# Altium schematic sheet Pec.SchDoc
size A3
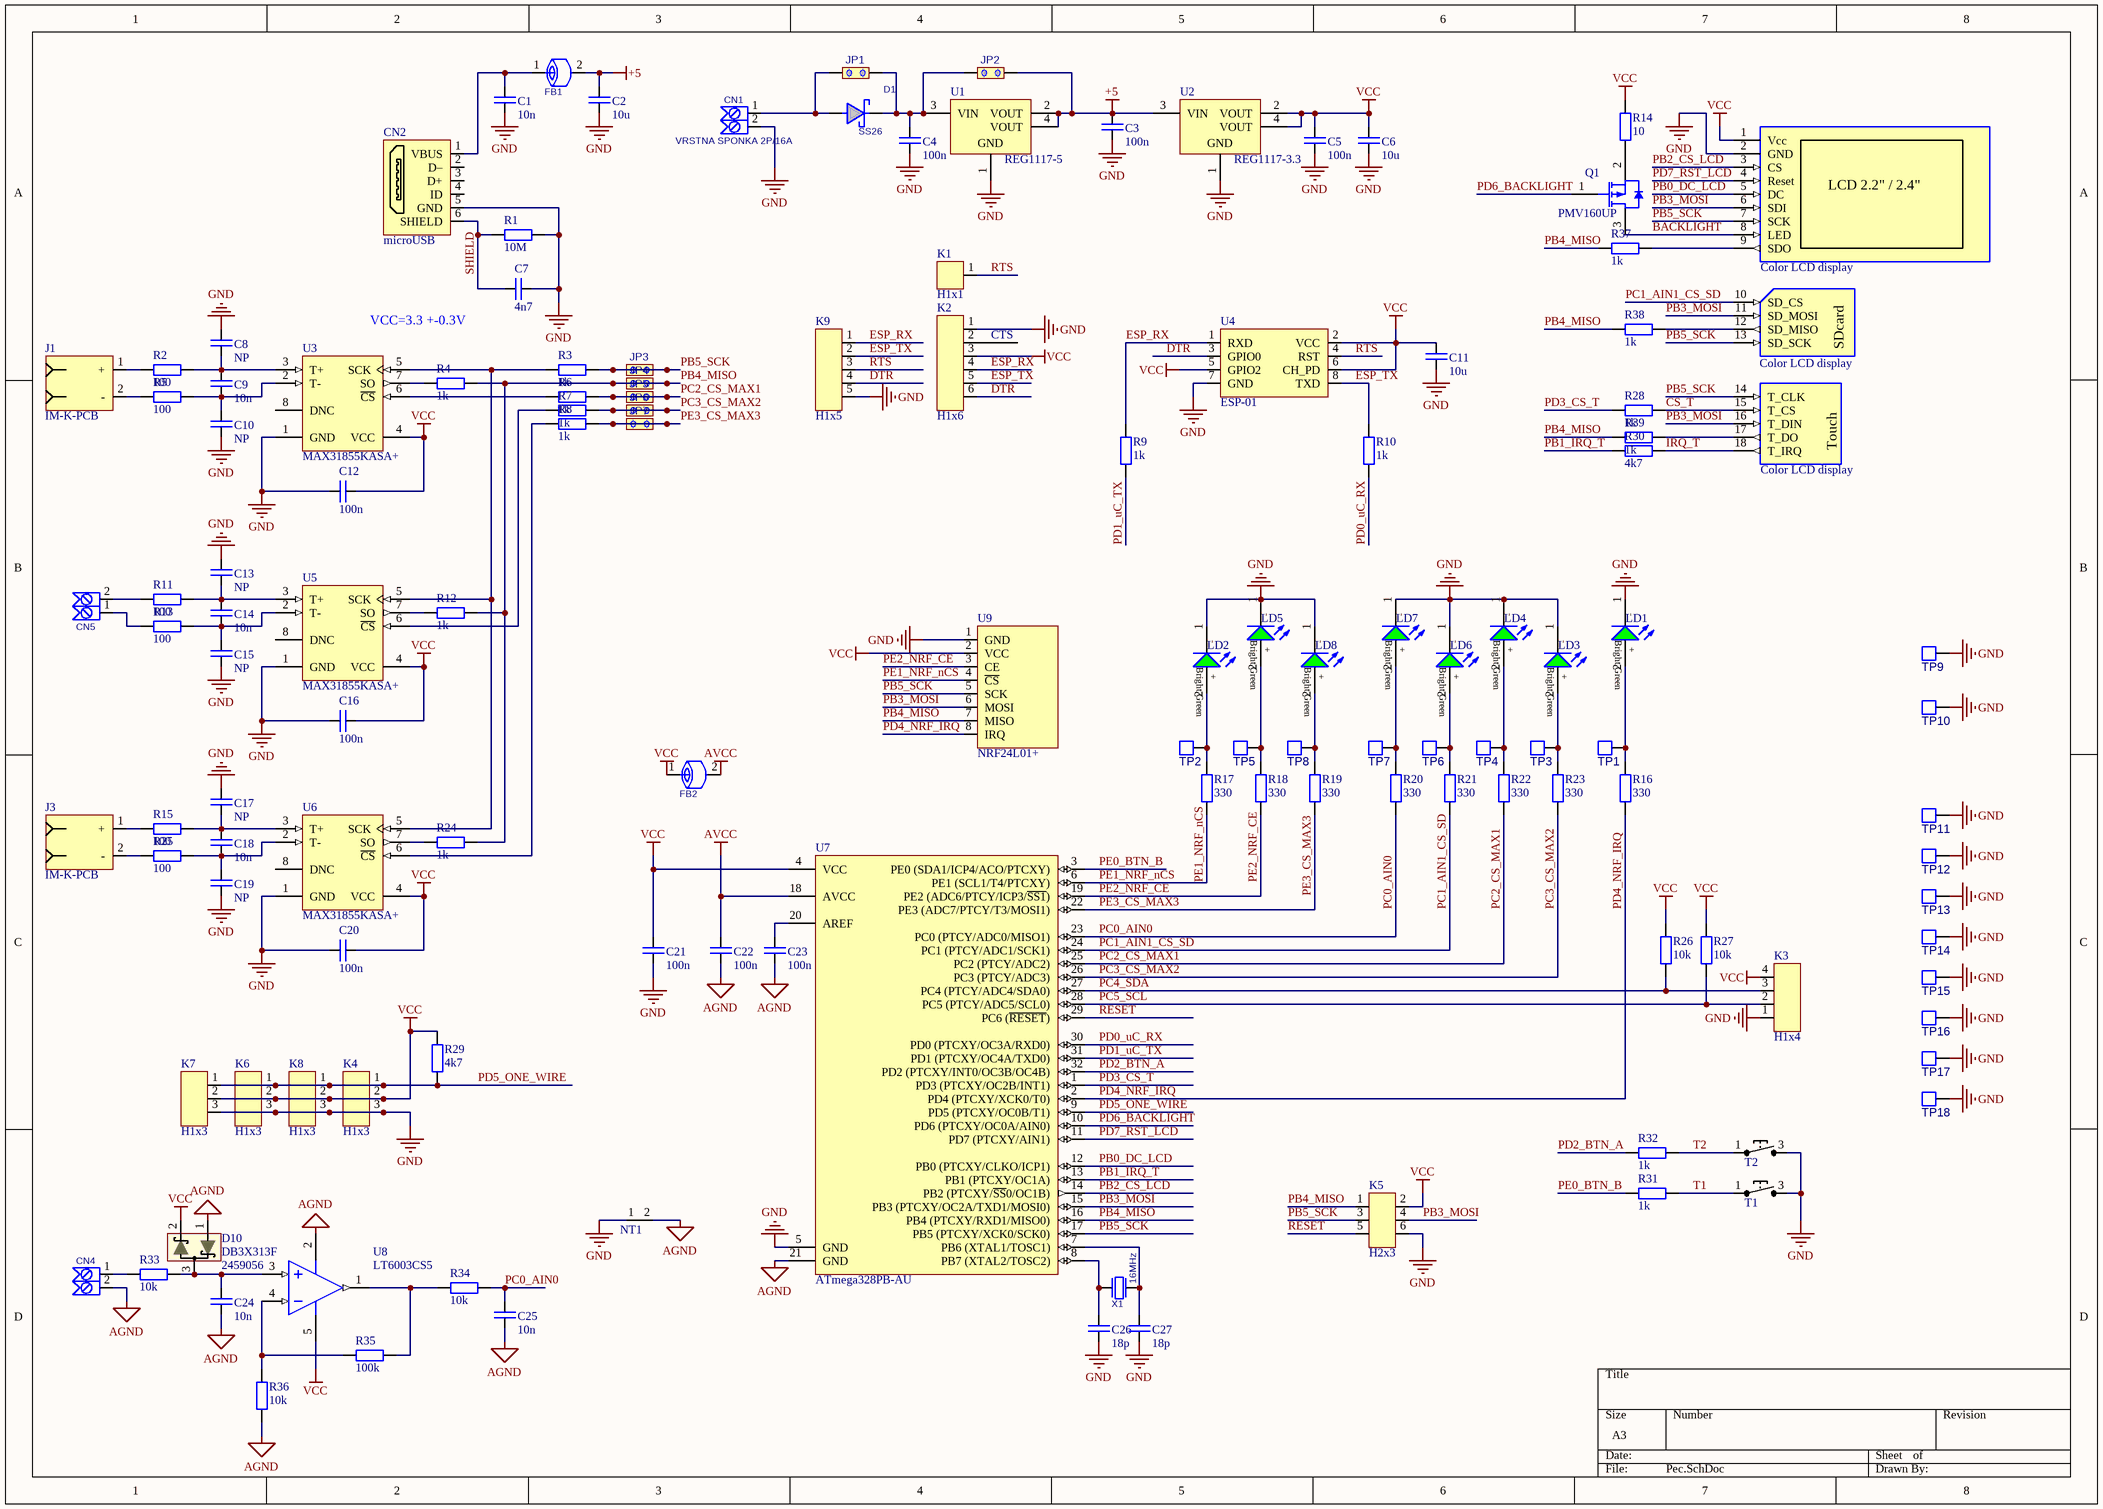
[diagram p0: Pec.SchDoc]

## Parts
C1  10n  [C2012_0805I_M]
C2  10u  [C3225_1210I_M]
C3  100n  [C2012_0805I_M]
C4  100n  [C2012_0805I_M]
C5  100n  [C2012_0805I_M]
C6  10u  [C3225_1210I_M]
C7  4n7  [C2012_0805I_M]
C8  NP  [C2012_0805I_M]
C9  10n  [C2012_0805I_M]
C10  NP  [C2012_0805I_M]
C11  10u  [C3225_1210I_M]
C12  100n  [C2012_0805I_M]
C13  NP  [C2012_0805I_M]
C14  10n  [C2012_0805I_M]
C15  NP  [C2012_0805I_M]
C16  100n  [C2012_0805I_M]
C17  NP  [C2012_0805I_M]
C18  10n  [C2012_0805I_M]
C19  NP  [C2012_0805I_M]
C20  100n  [C2012_0805I_M]
C21  100n  [C2012_0805I_M]
C22  100n  [C2012_0805I_M]
C23  100n  [C2012_0805I_M]
C24  10n  [C2012_0805I_M]
C25  10n  [C2012_0805I_M]
C26  18p  [C2012_0805I_M]
C27  18p  [C2012_0805I_M]
CN1  VRSTNA SPONKA 2P/16A  [VRSTNA SPONKA 2P/16A]
CN2  microUSB  [micro-USB-HRS-ZX62D-B-5PA8]
CN4  VRSTNA SPONKA 2P/16A  [VRSTNA SPONKA 2P/16A]  (value not drawn)
CN5  VRSTNA SPONKA 2P/16A  [VRSTNA SPONKA 2P/16A]  (value not drawn)
D1  SS26  [DO-214AA_SMB_M]
D10  DB3X313F  Supplier Part Number 1: 2459056  [SOT23]
FB1  FERITTE BEAD  [R2012_0805I_M]  (value not drawn)
FB2  FERITTE BEAD  [R2012_0805I_M]  (value not drawn)
J1  IM-K-PCB  [IM-x-PCB]
J3  IM-K-PCB  [IM-x-PCB]
JP1  JMP  [solderJumper]  (value not drawn)
JP2  JMP  [H1x2+solderJumper]  (value not drawn)
JP3  JMP  [H1x2]  (value not drawn)
JP4  JMP  [H1x2]  (value not drawn)
JP5  JMP  [H1x2]  (value not drawn)
JP6  JMP  [H1x2]  (value not drawn)
JP7  JMP  [H1x2]  (value not drawn)
K1  H1x1  [H1x1]
K2  H1x6  [H1x6]
K3  H1x4  [H1x4]
K4  H1x3  [H1x3]
K5  H2x3  [H2X3_SPEEDY]
K6  H1x3  [H1x3]
K7  H1x3  [H1x3]
K8  H1x3  [H1x3]
K9  H1x5  [H1x5]
LCD1  Color LCD display  [LCD_display]  (parts A,B,C of 3)
LD1  LED  [LED2012_0805I_M]  (value not drawn)
LD2  LED  [LED2012_0805I_M]  (value not drawn)
LD3  LED  [LED2012_0805I_M]  (value not drawn)
LD4  LED  [LED2012_0805I_M]  (value not drawn)
LD5  LED  [LED2012_0805I_M]  (value not drawn)
LD6  LED  [LED2012_0805I_M]  (value not drawn)
LD7  LED  [LED2012_0805I_M]  (value not drawn)
LD8  LED  [LED2012_0805I_M]  (value not drawn)
NT1  NetTie  [NetTie-10mil]  (value not drawn)  (net tie, no BOM)
Q1  PMV160UP  [NXP-SOT23_N]
R1  10M  [R2012_0805I_M]
R2  100  [R2012_0805I_M]
R3  1k  [R2012_0805I_M]
R4  1k  [R2012_0805I_M]
R5  100  [R2012_0805I_M]
R6  1k  [R2012_0805I_M]
R7  1k  [R2012_0805I_M]
R8  1k  [R2012_0805I_M]
R9  1k  [R2012_0805I_M]
R10  1k  [R2012_0805I_M]
R11  100  [R2012_0805I_M]
R12  1k  [R2012_0805I_M]
R13  100  [R2012_0805I_M]
R14  10  [R2012_0805I_M]
R15  100  [R2012_0805I_M]
R16  330  [R2012_0805I_M]
R17  330  [R2012_0805I_M]
R18  330  [R2012_0805I_M]
R19  330  [R2012_0805I_M]
R20  330  [R2012_0805I_M]
R21  330  [R2012_0805I_M]
R22  330  [R2012_0805I_M]
R23  330  [R2012_0805I_M]
R24  1k  [R2012_0805I_M]
R25  100  [R2012_0805I_M]
R26  10k  [R2012_0805I_M]
R27  10k  [R2012_0805I_M]
R28  1k  [R2012_0805I_M]
R29  4k7  [R2012_0805I_M]
R30  4k7  [R2012_0805I_M]
R31  1k  [R2012_0805I_M]
R32  1k  [R2012_0805I_M]
R33  10k  [R2012_0805I_M]
R34  10k  [R2012_0805I_M]
R35  100k  [R2012_0805I_M]
R36  10k  [R2012_0805I_M]
R37  1k  [R2012_0805I_M]
R38  1k  [R2012_0805I_M]
R39  1k  [R2012_0805I_M]
T1  Tipka_6x6  [Tipka 6x6]  (value not drawn)
T2  Tipka_6x6  [Tipka 6x6]  (value not drawn)
TP1  PAD  [PAD_HOLE]  (value not drawn)
TP2  PAD  [PAD_HOLE]  (value not drawn)
TP3  PAD  [PAD_HOLE]  (value not drawn)
TP4  PAD  [PAD_HOLE]  (value not drawn)
TP5  PAD  [PAD_HOLE]  (value not drawn)
TP6  PAD  [PAD_HOLE]  (value not drawn)
TP7  PAD  [PAD_HOLE]  (value not drawn)
TP8  PAD  [PAD_HOLE]  (value not drawn)
TP9  PAD  [PAD_CIRC_HOLE]  (value not drawn)
TP10  PAD  [PAD_CIRC_HOLE]  (value not drawn)
TP11  PAD  [PAD_CIRC_HOLE]  (value not drawn)
TP12  PAD  [PAD_CIRC_HOLE]  (value not drawn)
TP13  PAD  [PAD_CIRC_HOLE]  (value not drawn)
TP14  PAD  [PAD_CIRC_HOLE]  (value not drawn)
TP15  PAD  [PAD_CIRC_HOLE]  (value not drawn)
TP16  PAD  [PAD_CIRC_HOLE]  (value not drawn)
TP17  PAD  [PAD_CIRC_HOLE]  (value not drawn)
TP18  PAD  [PAD_CIRC_HOLE]  (value not drawn)
U1  REG1117-5  [TI-DCY4_N]
U2  REG1117-3.3  [TI-DCY4_N]
U3  MAX31855KASA+  [MAXM-S8+4_M]
U4  ESP-01  [ESP01]
U5  MAX31855KASA+  [MAXM-S8+4_M]
U6  MAX31855KASA+  [MAXM-S8+4_M]
U7  ATmega328PB-AU  [32A_N]
U8  LT6003CS5  [LT-S5-5-TSOT-23_M]
U9  NRF24L01+  [NRF24L01+tht_module]
X1  16MHz  [Crystal_HC49]

## Nets
+5: C2.1 C3.1 FB1.2 JP2.1 U1.2(VOUT) U1.4(VOUT) U2.3(VIN)
AGND: C22.2 C23.2 C24.2 C25.2 CN4.2 D10.1 NT1.2 R36.1 U7.21(GND) U8.2(V-)
AVCC: C22.1 FB2.2 U7.18(AVCC)
GND: C1.2 C2.2 C3.2 C4.2 C5.2 C6.2 C7.1 C8.1 C10.2 C11.2 C12.1 C13.1 C15.2 C16.1 C17.1 C19.2 C20.1 C21.2 C26.2 C27.2 CN1.2 CN2.5(GND) K2.1 K3.1 K4.3 K5.6 K6.3 K7.3 K8.3 K9.5 LCD1.2(GND) LCD1.M0(Screw) LD1.1(-) LD2.1(-) LD3.1(-) LD4.1(-) LD5.1(-) LD6.1(-) LD7.1(-) LD8.1(-) NT1.1 R1.2 T1.3 T2.3 TP9.1 TP10.1 TP11.1 TP12.1 TP13.1 TP14.1 TP15.1 TP16.1 TP17.1 TP18.1 U1.1(GND) U2.1(GND) U3.1(GND) U4.7(GND) U5.1(GND) U6.1(GND) U7.5(GND) U9.1(GND)
VCC: C5.1 C6.1 C11.1 C12.2 C16.2 C20.2 C21.1 D10.2 FB2.1 K2.3 K3.4 K4.2 K5.2 K6.2 K7.2 K8.2 LCD1.1(Vcc) R14.2 R26.2 R27.2 R29.2 U2.2(VOUT) U2.4(VOUT) U3.4(VCC) U4.2(VCC) U4.5(GPIO2) U4.6(CH_PD) U5.4(VCC) U6.4(VCC) U7.4(VCC) U8.5(V+) U9.2(VCC)
BACKLIGHT: LCD1.8(LED) Q1.3(D)
CS_T: LCD1.15(T_CS) R28.2
DTR: K2.6 K9.4 U4.3(GPIO0)
ESP_RX: K2.4 K9.1 R9.2 U4.1(RXD)
ESP_TX: K2.5 K9.2 R10.2 U4.8(TXD)
IRQ_T: LCD1.18(T_IRQ) R30.2
PB0_DC_LCD: LCD1.5(DC) U7.12(PB0_(PTCXY/CLKO/ICP1))
PB1_IRQ_T: R30.1 U7.13(PB1_(PTCXY/OC1A))
PB2_CS_LCD: LCD1.3(CS) U7.14(PB2_(PTCXY/~{SS}0/OC1B))
PB3_MOSI: K5.4 LCD1.6(SDI) LCD1.11(SD_MOSI) LCD1.16(T_DIN) U7.15(PB3_(PTCXY/OC2A/TXD1/MOSI0)) U9.6(MOSI)
PB4_MISO: JP4.1 JP4.2 K5.1 R4.2 R12.2 R24.2 R37.1 R38.1 R39.1 U7.16(PB4_(PTCXY/RXD1/MISO0)) U9.7(MISO)
PB5_SCK: JP3.1 JP3.2 K5.3 LCD1.7(SCK) LCD1.13(SD_SCK) LCD1.14(T_CLK) R3.2 U7.17(PB5_(PTCXY/XCK0/SCK0)) U9.5(SCK)
PC0_AIN0: C25.1 R20.1 R34.2 U7.23(PC0_(PTCY/ADC0/MISO1))
PC1_AIN1_CS_SD: LCD1.10(SD_CS) R21.1 U7.24(PC1_(PTCY/ADC1/SCK1))
PC2_CS_MAX1: JP5.1 JP5.2 R6.2 R22.1 U7.25(PC2_(PTCY/ADC2))
PC3_CS_MAX2: JP6.1 JP6.2 R7.2 R23.1 U7.26(PC3_(PTCY/ADC3))
PC4_SDA: K3.3 R26.1 U7.27(PC4_(PTCY/ADC4/SDA0))
PC5_SCL: K3.2 R27.1 U7.28(PC5_(PTCY/ADC5/SCL0))
PD0_uC_RX: R10.1 U7.30(PD0_(PTCXY/OC3A/RXD0))
PD1_uC_TX: R9.1 U7.31(PD1_(PTCXY/OC4A/TXD0))
PD2_BTN_A: R32.1 U7.32(PD2_(PTCXY/INT0/OC3B/OC4B))
PD3_CS_T: R28.1 U7.1(PD3_(PTCXY/OC2B/INT1))
PD4_NRF_IRQ: R16.1 U7.2(PD4_(PTCXY/XCK0/T0)) U9.8(IRQ)
PD5_ONE_WIRE: K4.1 K6.1 K7.1 K8.1 R29.1 U7.9(PD5_(PTCXY/OC0B/T1))
PD6_BACKLIGHT: Q1.1(G) U7.10(PD6_(PTCXY/OC0A/AIN0))
PD7_RST_LCD: LCD1.4(Reset) U7.11(PD7_(PTCXY/AIN1))
PE0_BTN_B: R31.2 U7.3(PE0_(SDA1/ICP4/ACO/PTCXY))
PE1_NRF_nCS: R17.1 U7.6(PE1_(SCL1/T4/PTCXY)) U9.4(~{CS})
PE2_NRF_CE: R18.1 U7.19(PE2_(ADC6/PTCY/ICP3/~{SS1})) U9.3(CE)
PE3_CS_MAX3: JP7.1 JP7.2 R8.2 R19.1 U7.22(PE3_(ADC7/PTCY/T3/MOSI1))
RESET: K5.5 U7.29(PC6_(~{RESET}))
RTS: K1.1 K9.3 U4.4(RST)
SHIELD: C7.2 CN2.6(SHIELD) R1.1
T1: R31.1 T1.1
T2: R32.2 T2.1
NetC1_1: C1.1 CN2.1(VBUS) FB1.1
NetC4_1: C4.1 D1.K JP1.1 JP2.2 U1.3(VIN)
NetC8_2: C8.2 C9.1 R2.2 U3.3(T+)
NetC9_2: C9.2 C10.1 R5.2 U3.2(T-)
NetC13_2: C13.2 C14.1 R11.2 U5.3(T+)
NetC14_2: C14.2 C15.1 R13.2 U5.2(T-)
NetC17_2: C17.2 C18.1 R15.2 U6.3(T+)
NetC18_2: C18.2 C19.1 R25.2 U6.2(T-)
NetC23_1: C23.1 U7.20(AREF)
NetC24_1: C24.1 D10.3 R33.2 U8.3(+IN)
NetC26_1: C26.1 U7.8(PB7_(XTAL2/TOSC2)) X1.1
NetC27_1: C27.1 U7.7(PB6_(XTAL1/TOSC1)) X1.2
NetCN1_1: CN1.1 D1.A JP1.2
NetCN4_1: CN4.1 R33.1
NetCN5_1: CN5.1 R13.1
NetCN5_2: CN5.2 R11.1
NetJ1_1: J1.1(+) R2.1
NetJ1_2: J1.2(-) R5.1
NetJ3_1: J3.1(+) R15.1
NetJ3_2: J3.2(-) R25.1
NetLCD1_9: LCD1.9(SDO) R37.2
NetLCD1_12: LCD1.12(SD_MISO) R38.2
NetLCD1_17: LCD1.17(T_DO) R39.2
NetLD1_2: LD1.2(+) R16.2 TP1.1
NetLD2_2: LD2.2(+) R17.2 TP2.1
NetLD3_2: LD3.2(+) R23.2 TP3.1
NetLD4_2: LD4.2(+) R22.2 TP4.1
NetLD5_2: LD5.2(+) R18.2 TP5.1
NetLD6_2: LD6.2(+) R21.2 TP6.1
NetLD7_2: LD7.2(+) R20.2 TP7.1
NetLD8_2: LD8.2(+) R19.2 TP8.1
NetQ1_2: Q1.2(S) R14.1
NetR3_1: R3.1 U3.5(SCK) U5.5(SCK) U6.5(SCK)
NetR4_1: R4.1 U3.7(SO)
NetR6_1: R6.1 U3.6(~{CS})
NetR7_1: R7.1 U5.6(~{CS})
NetR8_1: R8.1 U6.6(~{CS})
NetR12_1: R12.1 U5.7(SO)
NetR24_1: R24.1 U6.7(SO)
NetR34_1: R34.1 R35.2 U8.1(OUT)
NetR35_1: R35.1 R36.2 U8.4(-IN)

Not connected (* = marked no-connect by the designer): CN2 2(D–) 3(D+) 4(ID); K2 2; U3 8(DNC); U5 8(DNC); U6 8(DNC)

## Notes on the sheet
- VCC=3.3 +-0.3V
- (near K2) CTS
- (in symbol LCD_module, part A) LCD 2.2" / 2.4"
- (in symbol LCD_module, part B) SDcard
- (in symbol LCD_module, part C) Touch
- (in symbol LED) Bright Green

## Library data of the parts
C1-C27 = C: Capacitor
CN2 = microUSB-B-socket (HIROSE ZX62D-B-5PA8): micro USB-B socket (HIROSE ZX62D-B-5PA8); pin to pad: 6>0; Supplier 1: Farnell; ComponentLink1URL: http://www.farnell.com/datasheets/1693470.pdf; ComponentLink1Description: http://www.farnell.com/datasheets/1693470.pdf; Supplier Part Number 1: 2300438
D1 = P6SMB6.8AT3: pin to pad: K>C; Value: *
D10 = DB3X313F: Schottky; Supplier 1: Farnell
JP1-JP7 = JMP: Value: {Value}
K1 = H1x1: Header 1x1 (male)
K2 = H1x6: Header 1x6 (male)
K3 = H1x4: Header 1x4 (male)
K4 K6-K8 = H1x3: Header 1x3 (male)
K5 = H2x3: Header 2x3 (male)
K9 = H1x5: Header 1x5 (male)
LCD1 = LCD_module: 2.2" or 2.4" LCD_module w/o Touch
NT1 = NetTie: Connetct different grounds together
Q1 = PMV160UP,215: P-Channel Trench MOSFET, -20 V, -1.2 A, -55 to 150 degC, 3-Pin SOT23, Tape and Reel; Manufacturer: NXP Semiconductors; Channel Type: P; Ciss [typ] (pF): 365; Coss [typ] (pF): 42; Packing: Tape & Reel; VGSth [typ] (V): -0.7; DatasheetVersion: Rev. 2; PackageVersion: 06-03-16, 03/2006; PackageReference: SOT23; PackageDescription: 3-Pin Small Outline Transistor Package, Body 2.9 x 1.3 mm, Pitch 0.95 mm; Supplier 1: Digi-Key; Supplier Part Number 1: 568-10320-2-ND; Supplier 2: Digi-Key; Supplier Part Number 2: 568-10320-1-ND; Supplier 3: Digi-Key; Supplier Part Number 3: 568-10320-6-ND; Supplier 4: Newark; Supplier Part Number 4: 54T9404; Supplier 5: Mouser; Supplier Part Number 5: 771-PMV160UP215; ID [max] (A): -1.2; VDS [max] (V): -20; Mounting Technology: Surface Mount; Code_JEDEC: TO-236AB; PartNumber: PMV160UP,215; ComponentLink1Description: Manufacturer URL; ComponentLink1URL: http://www.nxp.com/; ComponentLink2Description: Datasheet; ComponentLink2URL: http://www.nxp.com/documents/data_sheet/PMV160UP.pdf; ComponentLink3Description: Package Specification; ComponentLink3URL: http://www.nxp.com/documents/outline_drawing/sot023_po.pdf
R1-R39 = R
T1 T2 = Tipka_6x6: tactile switch SMD; pin to pad: 1>1+2 3>3+4
U1 = REG1117-5: Single Output LDO, 800 mA, Fixed 5 V Output, 3.8 to 15 V Input, with Internal Current Limiting, 4-pin SOT-223 (DCY), -40 to 125 degC, Green (RoHS & no Sb/Br); Manufacturer: Texas Instruments; Iout(Max)(A): 0.8; Iq(Typ)(mA): 4; Rating: Catalog; SubFamily: Single Channel LDO; Vdo(Typ)(mV): 1100; Vin(Max)(V): 15; Vin(Min)(V): 3.8; Vout Adj(Max)(V): 5; DatasheetVersion: SBVS001D; PackageVersion: 4202506/B; PackageReference: DCY4; PackageDescription: 4-Pin Plastic Small Outline, Body 3.5 x 6.5 mm, Pitch 2.3 mm; Supplier 1: Digi-Key; Supplier Part Number 1: REG1117-5-ND; Supplier 2: Farnell; Supplier Part Number 2: 1212858; Supplier 3: Farnell; Supplier Part Number 3: 1212858RL; Supplier 4: Newark; Supplier Part Number 4: 20M1510; Supplier 5: Mouser; Supplier Part Number 5: 595-REG1117-5; Eco-Plan: Green (RoHS & no Sb/Br); Vout Adj(Min)(V): 5; Mounting Technology: Surface Mount; Code_JEDEC: TO-261; PartNumber: REG1117-5; ComponentLink1Description: Manufacturer URL; ComponentLink1URL: http://www.ti.com/; ComponentLink2Description: Datasheet; ComponentLink2URL: http://www.ti.com/general/docs/lit/getliterature.tsp?genericPartNumber=REG1117-5&fileType=pdf; ComponentLink3Description: Package Specification; ComponentLink3URL: http://www.ti.com/litv/pdf/mpds094a
U2 = REG1117-3.3: Single Output LDO, 800 mA, Fixed 3.3 V Output, 3.8 to 15 V Input, with Internal Current Limiting, 4-pin SOT-223 (DCY), -40 to 125 degC, Green (RoHS & no Sb/Br); Manufacturer: Texas Instruments; Fixed Output Options(V): 5; Iout(Max)(A): 0.8; Iq(Typ)(mA): 4; Rating: Catalog; SubFamily: Single Channel LDO; Vdo(Typ)(mV): 1100; Vin(Max)(V): 15; Vin(Min)(V): 3.8; Vout Adj(Max)(V): 3.3; DatasheetVersion: SBVS001D; PackageVersion: 4202506/B; PackageReference: DCY4; PackageDescription: 4-Pin Plastic Small Outline, Body 3.5 x 6.5 mm, Pitch 2.3 mm; Supplier 1: Digi-Key; Supplier Part Number 1: REG1117-3.3-ND; Supplier 2: Farnell; Supplier Part Number 2: 1212355; Supplier 3: Farnell; Supplier Part Number 3: 2126471; Supplier 4: Newark; Supplier Part Number 4: 35C1963; Supplier 5: Mouser; Supplier Part Number 5: 595-REG1117-3.3; Eco-Plan: Green (RoHS & no Sb/Br); Vout Adj(Min)(V): 3.3; Mounting Technology: Surface Mount; Code_JEDEC: TO-261; PartNumber: REG1117-3.3; ComponentLink1Description: Manufacturer URL; ComponentLink1URL: http://www.ti.com/; ComponentLink2Description: Datasheet; ComponentLink2URL: http://www.ti.com/general/docs/lit/getliterature.tsp?genericPartNumber=REG1117-33&fileType=pdf; ComponentLink3Description: Package Specification; ComponentLink3URL: http://www.ti.com/litv/pdf/mpds094a
U3 U5 U6 = MAX31855KASA+: Cold Junction Compensated Thermocouple to Digital Converter, 14 Bits Temperature Resolution, -40 to 125 degC, 8-Pin SOIC (S8+4), Pb-Free; Functions: Thermocouple-to-Digital Converter; Interface: SPI; Parasite Pwr.: No; DatasheetVersion: Rev. 2; PackageVersion: Rev. D, 10/2012; PackageReference: S8+4; PackageDescription: 8-Pin Small-Outline IC, Narrow, Body 3.9 x 4.9 mm, Pitch 1.27 mm; Supplier 1: Digi-Key; Supplier Part Number 1: MAX31855KASA+-ND; Supplier 2: Mouser; Supplier Part Number 2: 700-MAX31855KASA+; Generic Part Number: MAX31855; Mounting Technology: Surface Mount; Code_JEDEC: MS-012; PartNumber: MAX31855KASA+; ComponentLink1Description: Manufacturer URL; ComponentLink1URL: http://www.maximintegrated.com/; ComponentLink2Description: Datasheet; ComponentLink2URL: http://datasheets.maximintegrated.com/en/ds/MAX31855.pdf; ComponentLink3Description: Package Specification; ComponentLink3URL: http://pdfserv.maximintegrated.com/package_dwgs/21-0041.PDF
U7 = ATmega328PB-AU: 8-bit AVR Microcontroller, 32KB Flash, 1KB EEPROM, 2KB SRAM, 32-pin TQFP, Industrial Grade (-40°C to 85°C); DatasheetVersion: revC, Oct-2015; PackageReference: 32A; PackageDescription: 32-Lead, 7x7x1.0 mm Body, 0.8mm Lead Pitch, Thin Profile Plastic Quad Flat Package (TQFP); Code_JEDEC: MS-026-ABA; ComponentLink1Description: Manufacturer URL; ComponentLink1URL: http://www.atmel.com/; ComponentLink2Description: ATmega328PB Datasheet; ComponentLink2URL: http://www.atmel.com/Images/Atmel-42397-8-bit-AVR-Microcontroller-ATmega328PB_Datasheet.pdf; ComponentLink3Description: ATmega328P Summary; ComponentLink3URL: http://www.atmel.com/Images/Atmel-42397-8-bit-AVR-Microcontroller-ATmega328PB_Summary.pdf
U8 = LT6003CS5: Single Channel, Precision Operational Amplifier, RRIO, 0.002 MHz Typical GBW, 0.0008 V/us Typical SR, 1.6 to 16 V, 5-Pin SOT23 (S5-5), Commercial; Linear Technology Part Number: LT6003; Manufacturer: Linear Technology; Channels (#): 1; GBW (MHz) Typical: 0.002; Is (mA) Typical: 0.00085; SR (V/us) Typical: 0.0008; Vos (mV) Guaranteed: 0.5; Vos (mV) Typical: 0.175; Vs Max (V): 16; Vs Min (V): 1.6; DatasheetVersion: Rev. D; PackageReference: LT-S5-5-TSOT-23; PackageDescription: 5-Lead Plastic TSOT-23, Body 1.63 x 2.90 mm, Pitch 0.95 mm; Type: VFB; Mounting Technology: Surface Mount; Code_JEDEC: MO-193; PartNumber: LT6003CS5; ComponentLink1Description: Manufacturer URL; ComponentLink1URL: http://www.linear.com/; ComponentLink2Description: Datasheet; ComponentLink2URL: http://cds.linear.com/docs/en/datasheet/600345fd.pdf; ComponentLink3Description: Package Specification; ComponentLink3URL: http://cds.linear.com/docs/en/packaging/SOT_5_05-08-1635.pdf
U9 = NRF24L01+: 2.4GHz low power, long range module
X1 = Crystal
CN1 CN4 CN5 = VRSTNA SPONKA 2P/16A: Value: *